# Altium project 2 лаба Вадим.PrjPcb
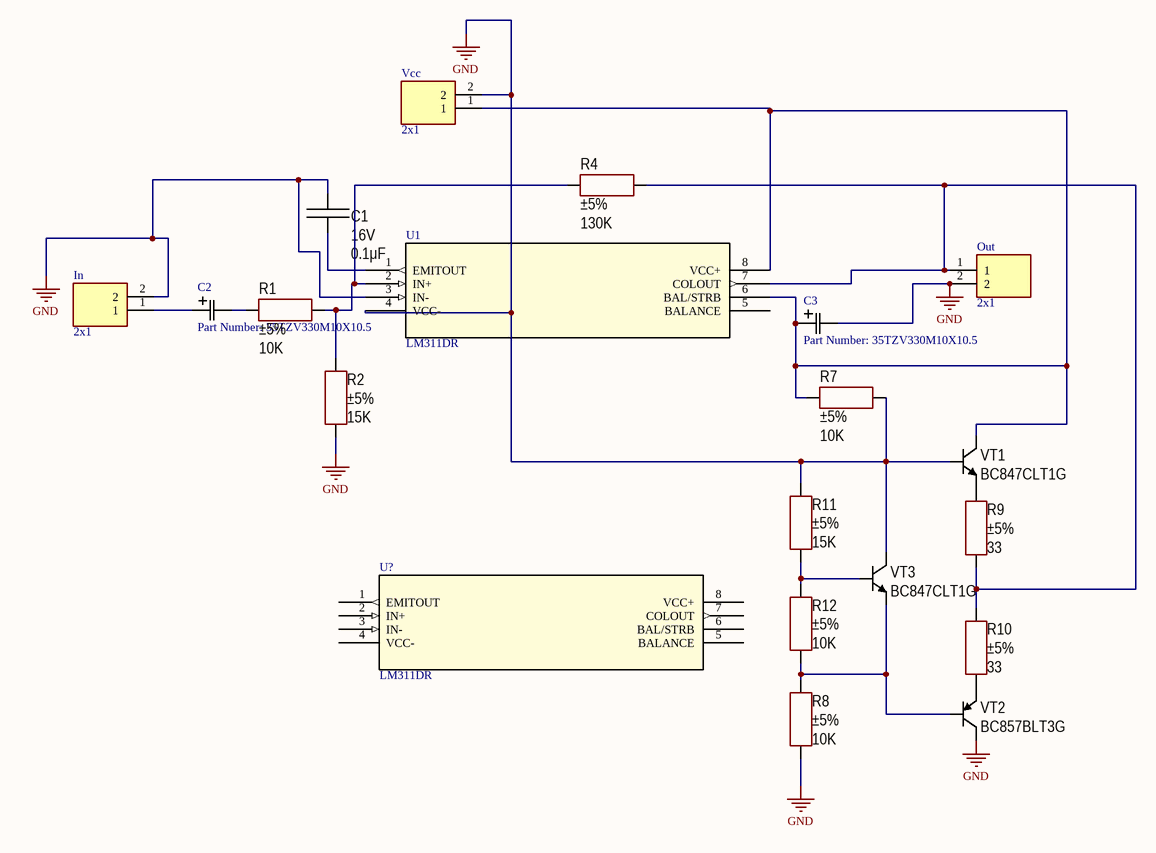
[diagram p0: pricipialka.SchDoc]
5 sheets, 20 parts. Net scope: global (net labels, ports and power ports of the same name join across sheets).
Board file: pechatka.PcbDoc
Sheets:
  pricipialka.SchDoc
  Перечень элементов.SchDoc
  Плата печатная.SchDoc
  Спецификация.SchDoc
  Спецификация 2.SchDoc

## Sheet pricipialka.SchDoc
size A4

### Parts
C1  value 0.1μF  Voltage: 16V  [CAP: 0805]
C2  Part Number: 35TZV330M10X10.5  [CAP_J-V_10X10P00]
C3  Part Number: 35TZV330M10X10.5  [CAP_J-V_10X10P00]
In  2х1  [2х1 SMD]
Out  2х1  [2х1 SMD]
R1  value 10K  Tolerance: ±5%  [RES: 0805]
R2  value 15K  Tolerance: ±5%  [RES: 0805]
R4  value 130K  Tolerance: ±5%  [RES: 0805]
R7  value 10K  Tolerance: ±5%  [RES: 0805]
R8  value 10K  Tolerance: ±5%  [RES: 0805]
R9  value 33  Tolerance: ±5%  [RES: 0805]
R10  value 33  Tolerance: ±5%  [RES: 0805]
R11  value 15K  Tolerance: ±5%  [RES: 0805]
R12  value 10K  Tolerance: ±5%  [RES: 0805]
U1  LM311DR  [D8]
U?  LM311DR  [D8]
Vcc  2х1  [2х1 SMD]
VT1  PartNumber: BC847CLT1G  [SOT23]
VT2  PartNumber: BC857BLT3G  [SOT23]
VT3  PartNumber: BC847CLT1G  [SOT23]

### Nets
GND: C1.2 C3.2 In.2 Out.2 R2.1 R7.2 R8.1 R11.2 U1.3(IN-) U1.4(VCC-) Vcc.2 VT1.1(B) VT2.3(C) VT3.3(C)
NetC1_1: C1.1 U1.1(EMITOUT)
NetC2_1: C2.1 In.1
NetC2_2: C2.2 R1.1
NetC3_1: C3.1 R7.1 U1.6(BAL/STRB) U1.8(VCC+) Vcc.1 VT1.3(C)
NetOut_1: Out.1 R4.2 R9.1 R10.2 U1.7(COLOUT)
NetR1_2: R1.2 R2.2 R4.1 U1.2(IN+)
NetR8_2: R8.2 R12.1 VT2.1(B) VT3.2(E)
NetR9_2: R9.2 VT1.2(E)
NetR10_1: R10.1 VT2.2(E)
NetR11_1: R11.1 R12.2 VT3.1(B)

Not connected (* = marked no-connect by the designer): U1 5(BALANCE); U? 1(EMITOUT) 2(IN+) 3(IN-) 4(VCC-) 5(BALANCE) 6(BAL/STRB) 7(COLOUT) 8(VCC+)

### Library data of the parts
C1 = Ceramic_0805: Manufacturer: Yageo; PartNumber: CC0805KRX7R7BB104; ValueManufacturerPartNumber: Ceramic capacitor, 0.1μF, X7R, ±10%, 16V, 0805, -55...+125°C; TypeCapacitor: Ceramic capacitor; Tolerance: ±10%; TypeDielectric: X7R; Package: 0805; HelpURL: https://www.digikey.com/product-detail/en/yageo/CC0805KRX7R7BB104/311-1142-1-ND/303052; Temperature: -55...+125°C
C2 C3 = 35TZV330M10X10.5: No Description Available; Vendor: Rubycon Netherlands; Built_By: EMA_Cory; Type: DEV; Manufacturer_Part_Number: 35TZV330M10X10.5; Copyright: Copyright (C) 2018 Accelerated Designs. All rights reserved; RefDes: RefDes; Value: Value
In Out Vcc = 2х1: Board-To-Board Connector, Straight, AMPMODU Mod II Series, Through Hole, Header, 2, 2.54 mm; MP: 826926-2; Centerline_Pitch: 2.54 mm[.1 in]; MF: TE Connectivity; Number_of_Positions: 2; Availability: Unavailable; Product_Type: Connector; Value: *; Package: None; SnapEDA_Link: https://www.snapeda.com/parts/826926-2/TE%20Connectivity%20AMP%20Connectors/view-part/554683/?ref=snap; TE_purchase_URL: https://www.te.com/usa-en/product-826926-2.html?te_bu=Cor&te_type=disp&te_campaign=seda_glo_cor-seda-global-disp-prtnr-fy19-seda-model-bom-cta_sma-317_1&elqCampaignId=32493; EU_RoHS_Compliance: Compliant; Price: None
R1 R7 R8 R12 = Resistor_0805: Manufacturer: Yageo; PartNumber: RC0805JR-07100RL; ValueManufacturerPartNumber: Resistor film, 10K, ±5%, 0805, 0.125W, -55...+125°C; TypeResistor: Resistor film; Power: 0.125W; Package: 0805; HelpURL: https://www.digikey.com/product-detail/en/yageo/RC0805JR-07100RL/311-100ARCT-ND/731185; Temperature: -55...+125°C
R2 R11 = Resistor_0805: Manufacturer: Yageo; PartNumber: RC0805JR-07100RL; ValueManufacturerPartNumber: Resistor film, 15K, ±5%, 0805, 0.125W, -55...+125°C; TypeResistor: Resistor film; Power: 0.125W; Package: 0805; HelpURL: https://www.digikey.com/product-detail/en/yageo/RC0805JR-07100RL/311-100ARCT-ND/731185; Temperature: -55...+125°C
R4 = Resistor_0805: Manufacturer: Yageo; PartNumber: RC0805JR-07100RL; ValueManufacturerPartNumber: Resistor film, 130K, ±5%, 0805, 0.125W, -55...+125°C; TypeResistor: Resistor film; Power: 0.125W; Package: 0805; HelpURL: https://www.digikey.com/product-detail/en/yageo/RC0805JR-07100RL/311-100ARCT-ND/731185; Temperature: -55...+125°C
R9 R10 = Resistor_0805: Manufacturer: Yageo; PartNumber: RC0805JR-07100RL; ValueManufacturerPartNumber: Resistor film, 33, ±5%, 0805, 0.125W, -55...+125°C; TypeResistor: Resistor film; Power: 0.125W; Package: 0805; HelpURL: https://www.digikey.com/product-detail/en/yageo/RC0805JR-07100RL/311-100ARCT-ND/731185; Temperature: -55...+125°C
U1 U? = LM311DR: Differential Comparator With Strobes; Manufacturer: Texas Instruments; GENERIC_PART_NUMBER: LM311; INDUSTRY_STD_PKG_TYPE: SOIC; PIN_COUNT: 8; PACKAGE_DESIGNATOR: D; Datasheet_URL: http://www.ti.com/lit/gpn/LM311; FAMILY_NAME: COMPARATOR; Copyright: Copyright (C) 2018 Accelerated Designs. All rights reserved; RefDes: RefDes; Type: DEV
VT1 VT3 = BJT_NPN_132: Manufacturer: ON Semiconductor; ValueManufacturerPartNumber: NPN transistor, 45V, 100mA, 100MHz, 300mW, 0.6V, 420, SOT-23, -55...+125°C; TypeTransistor: NPN transistor; VoltageCE: 45V; CurrentCE: 100mA; VoltageSaturation: 0.6V; Frequency: 100MHz; CurrentGain: 420; MaxPower: 300mW; Package: SOT-23; HelpURL: https://www.digikey.com/product-detail/en/on-semiconductor/BC847CLT1G/BC847CLT1GOSCT-ND/917836; Temperature: -55...+125°C
VT2 = BJT_PNP_123: Manufacturer: ON Semiconductor; ValueManufacturerPartNumber: PNP transistor, 45V, 100mA, 100MHz, 300mW, 0.65V, 220, SOT-23, -55...+125°C; TypeTransistor: PNP transistor; VoltageCE: 45V; CurrentCE: 100mA; VoltageSaturation: 0.65V; Frequency: 100MHz; CurrentGain: 220; MaxPower: 300mW; Package: SOT-23; HelpURL: https://www.digikey.com/product-detail/en/on-semiconductor/BC857BLT3G/BC857BLT3GOSCT-ND/2704963; Temperature: -55...+125°C

## Sheet Перечень элементов.SchDoc
size 209 x 297 mm; ApprovedBy: 1; CheckedBy: 2; Author: 3; SheetNumber: 1; SheetTotal: 1; Разработал: Гончаренко В.Ю.; Проверил: Смолин В.А.; Обозначение: СФ МЭИ ПЭ2-18 11.03.04 03 ПЭ3; Наименование1: Плата печатная; Наименование2: Перечень элементов; Литера2: У; Утвердил: Рассказа Д.С.; Компания: СФ НИУ МЭИ
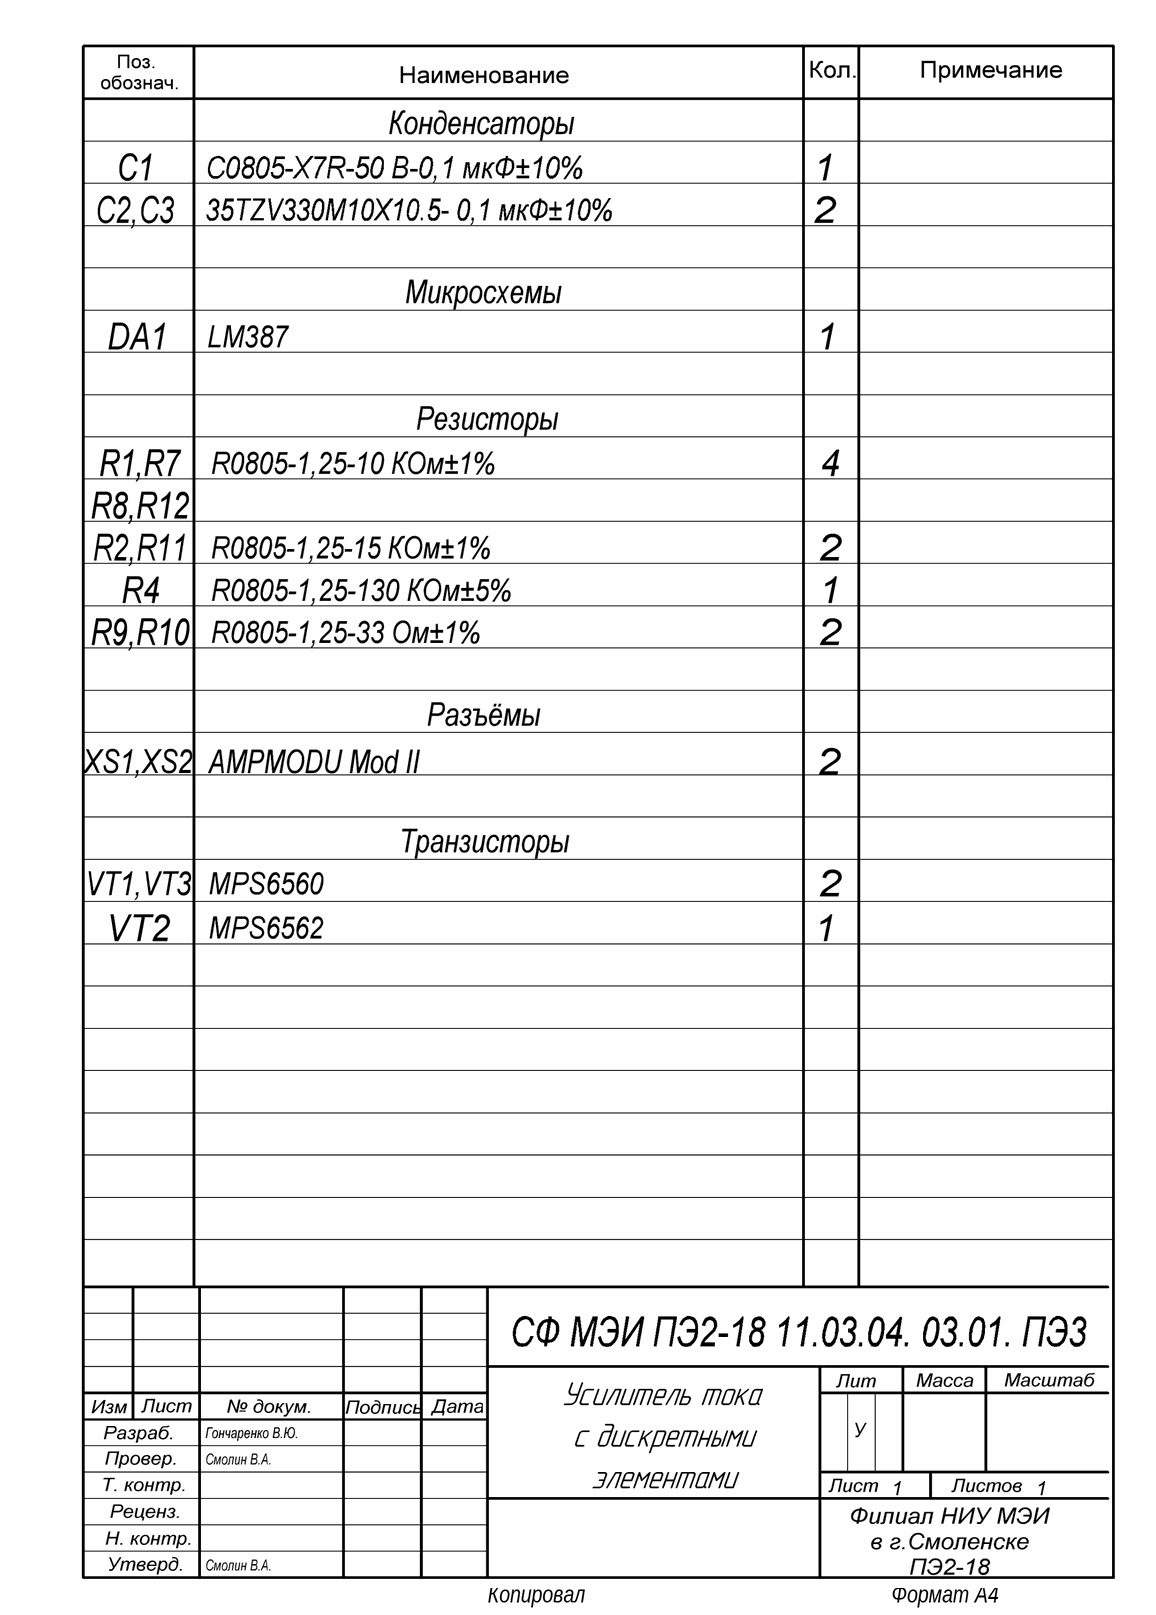
[diagram p1: Перечень элементов.SchDoc]

### Notes on the sheet
- Рассказа Д.С.
- Перв. примен.
- Справ. №
- Подп. и дата
- Инв. № дубл.
- Взам. инв. №
- Разраб.
- Изм.
- Лист
- № докум.
- Подп.
- Дата
- Лит.
- Масса
- Масштаб
- Пров.
- Т. контр.
- Листов
- Инв. № подл.
- Н. контр.
- Утв.
- Копировал
- Формат А4

## Sheet Плата печатная.SchDoc
size 420 x 297 mm; Децимальный номер: СФ МЭИ КР ПЭ2-18 11.03.04 03; Наименование. Строка 2: плата; Наименование. Строка 1: Печатная; Разработал: Гончаренко В.Ю.; Проверил: Смолин В.А.; Утвердил: Рассказа Д,С.; Литера: У; Масштаб: 2:1; Лист. Номер: 1; Лист. Всего: 4; Организация: НИУ СФ МЭИ
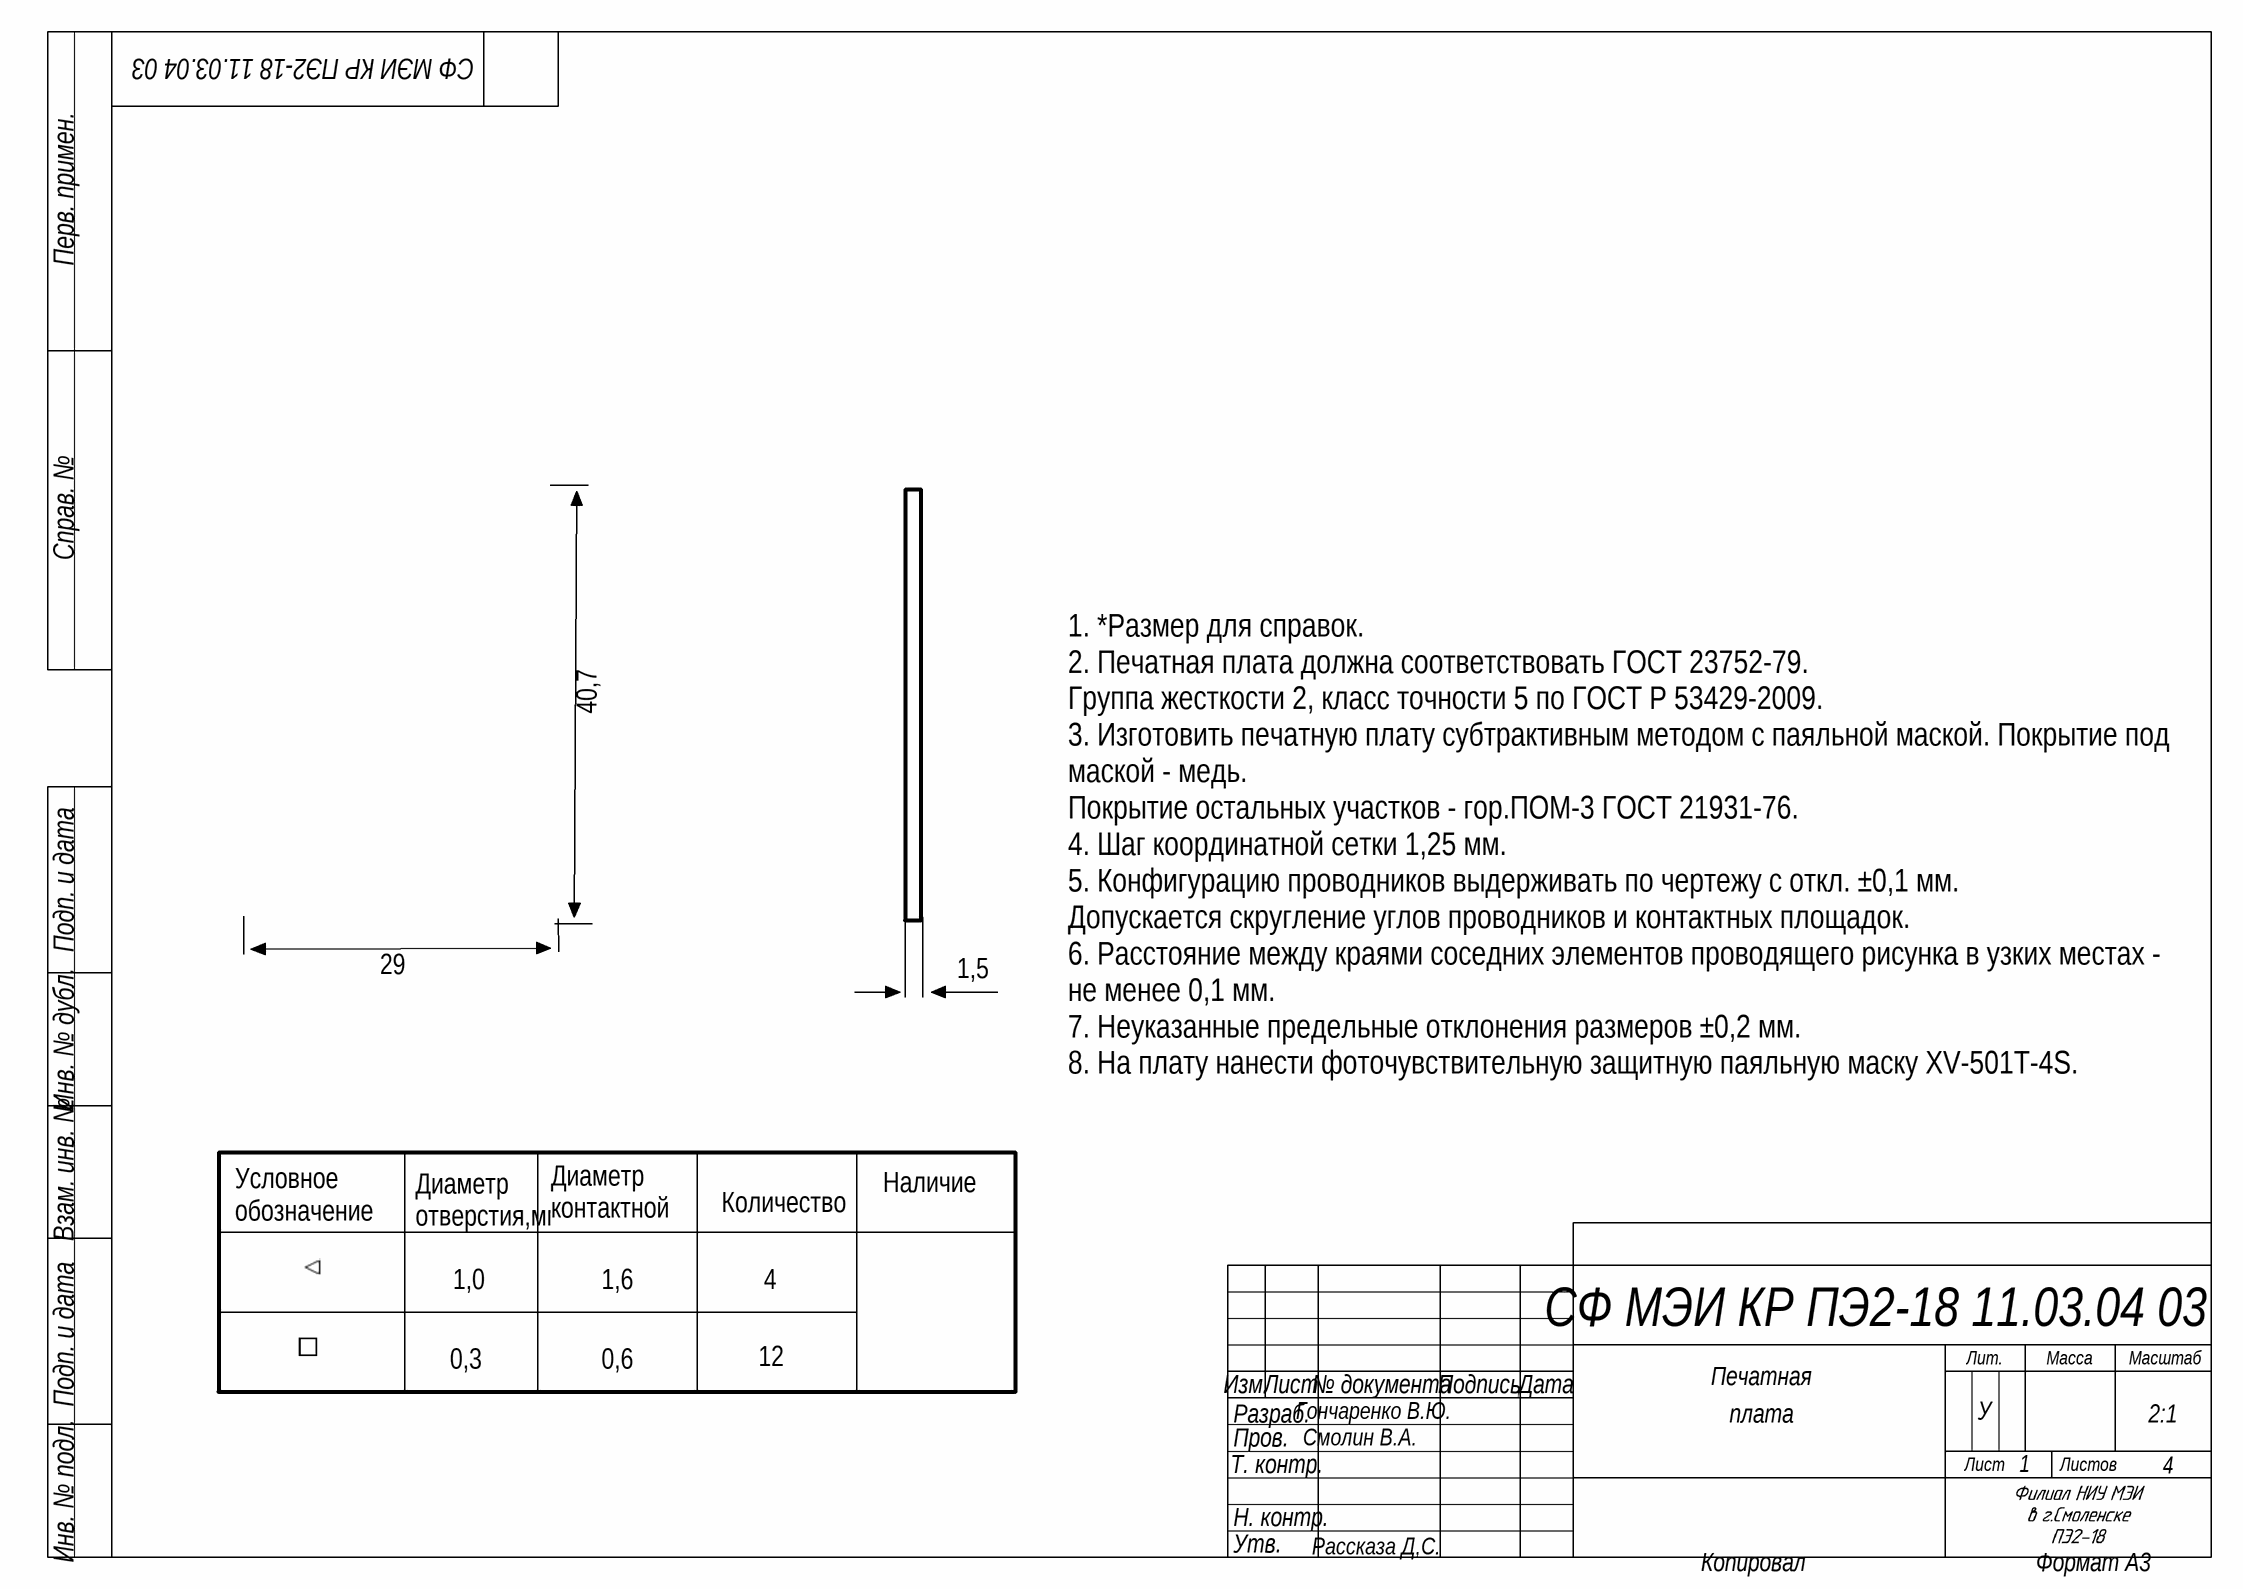
[diagram p2: Плата печатная.SchDoc]

### Notes on the sheet
- 40,7
- 29
- 1,5
- 1. *Размер для справок.
  2. Печатная плата должна соответствовать ГОСТ 23752-79.
  Группа жесткости 2, класс точности 5 по ГОСТ Р 53429-2009.
  3. Изготовить печатную плату субтрактивным методом с паяльной маской. Покрытие под маской - медь.
  Покрытие остальных участков - гор.ПОМ-3 ГОСТ 21931-76.
  4. Шаг координатной сетки 1,25 мм.
  5. Конфигурацию проводников выдерживать по чертежу с откл. ±0,1 мм.
  Допускается скругление углов проводников и контактных площадок.
  6. Расстояние между краями соседних элементов проводящего рисунка в узких местах - не менее 0,1 мм.
  7. Неуказанные предельные отклонения размеров ±0,2 мм.
  8. На плату нанести фоточувствительную защитную паяльную маску XV-501T-4S.
- Условное
  обозначение
  отверстия
- Диаметр
  отверстия,мм
- Диаметр
  контактной
  площадки,мм
- Количество
- Наличие
  металлизации
- 1,0
- 1,6
- 4
- Есть
- 0,3
- 0,6
- 12
- Перв. примен.
- Справ. №
- Подп. и дата
- Инв. № дубл.
- Взам. инв. №
- Разраб.
- Изм.
- Лист
- № документа
- Подпись
- Дата
- Лит.
- Масса
- Масштаб
- Т. контр.
- Пров.
- Листов
- Инв. № подл.
- Н. контр.
- Утв.
- Копировал
- Формат A3

## Sheet Спецификация.SchDoc
size 209 x 297 mm

### Notes on the sheet
- Перв. примен.
- Справ. №
- Подп. и дата
- Инв. № дубл.
- Взам. инв. №
- Разраб.
- Изм.
- Лист
- № докум.
- Подп.
- Дата
- Лит.
- Масса
- Масштаб
- Пров.
- Т. контр.
- Листов
- Инв. № подл.
- Н. контр.
- Утв.
- Копировал
- Формат А4
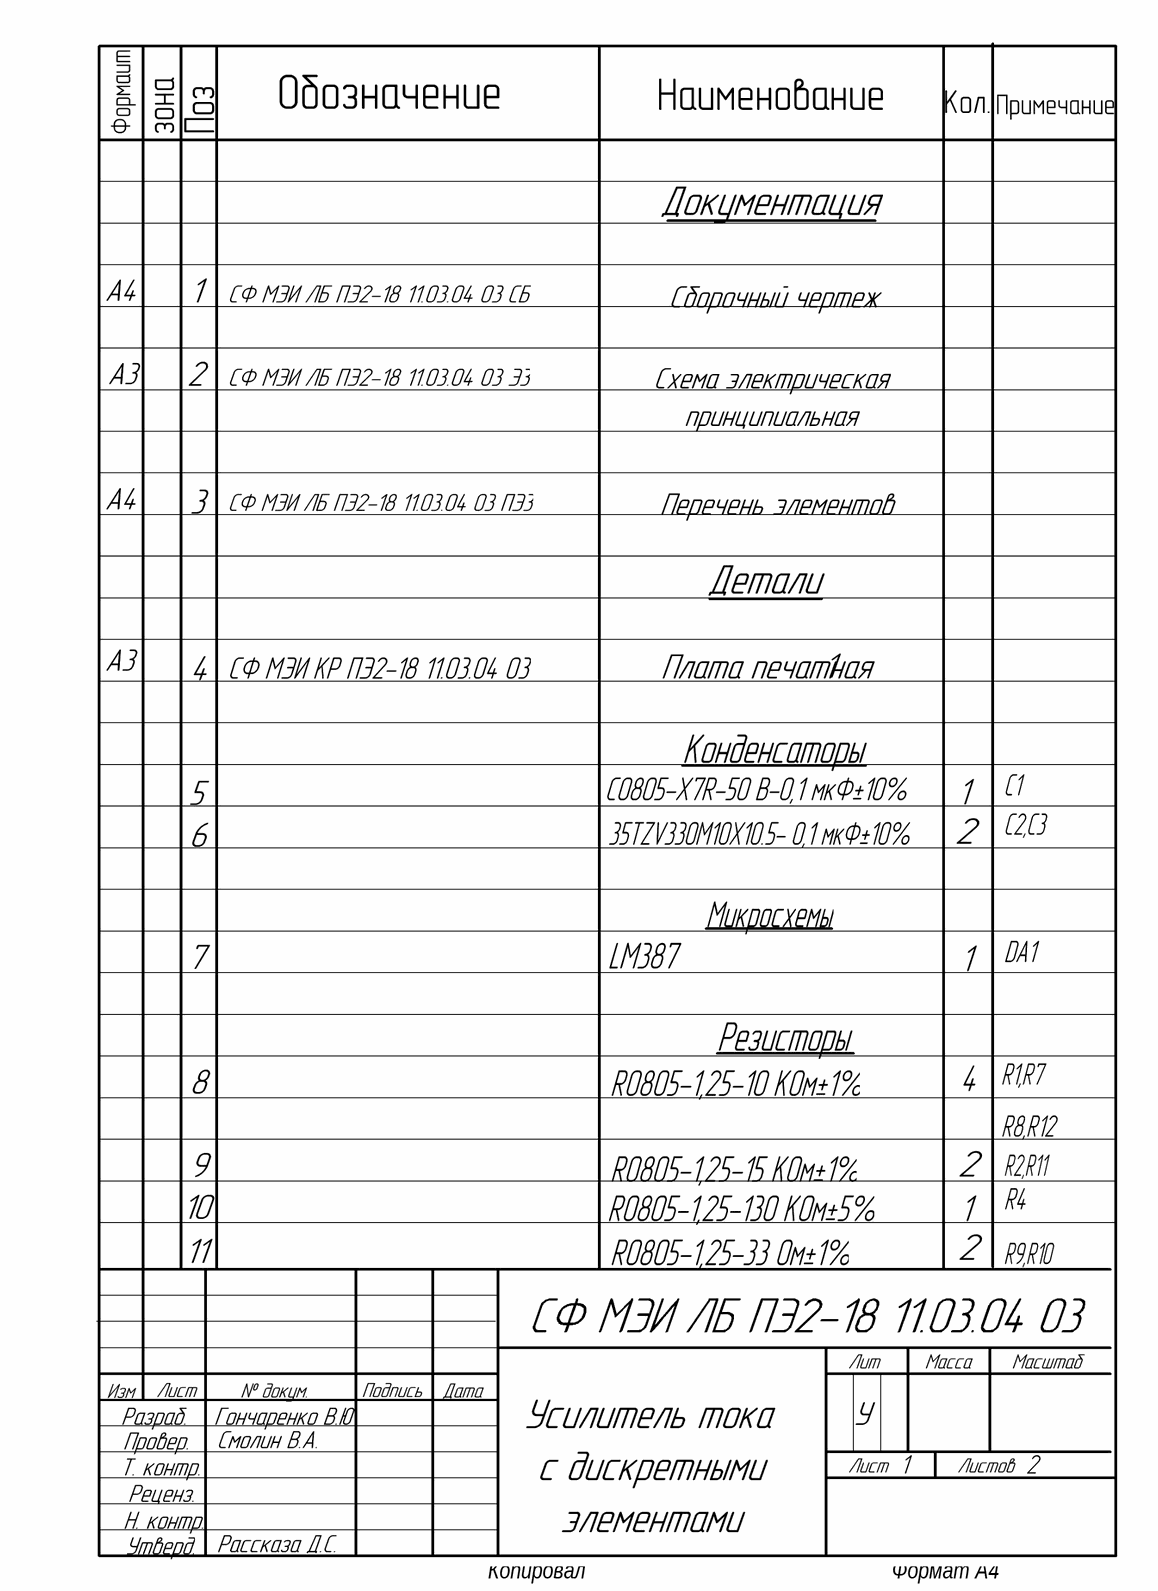
[diagram p3: Спецификация.SchDoc]

## Sheet Спецификация 2.SchDoc
size 209 x 297 mm
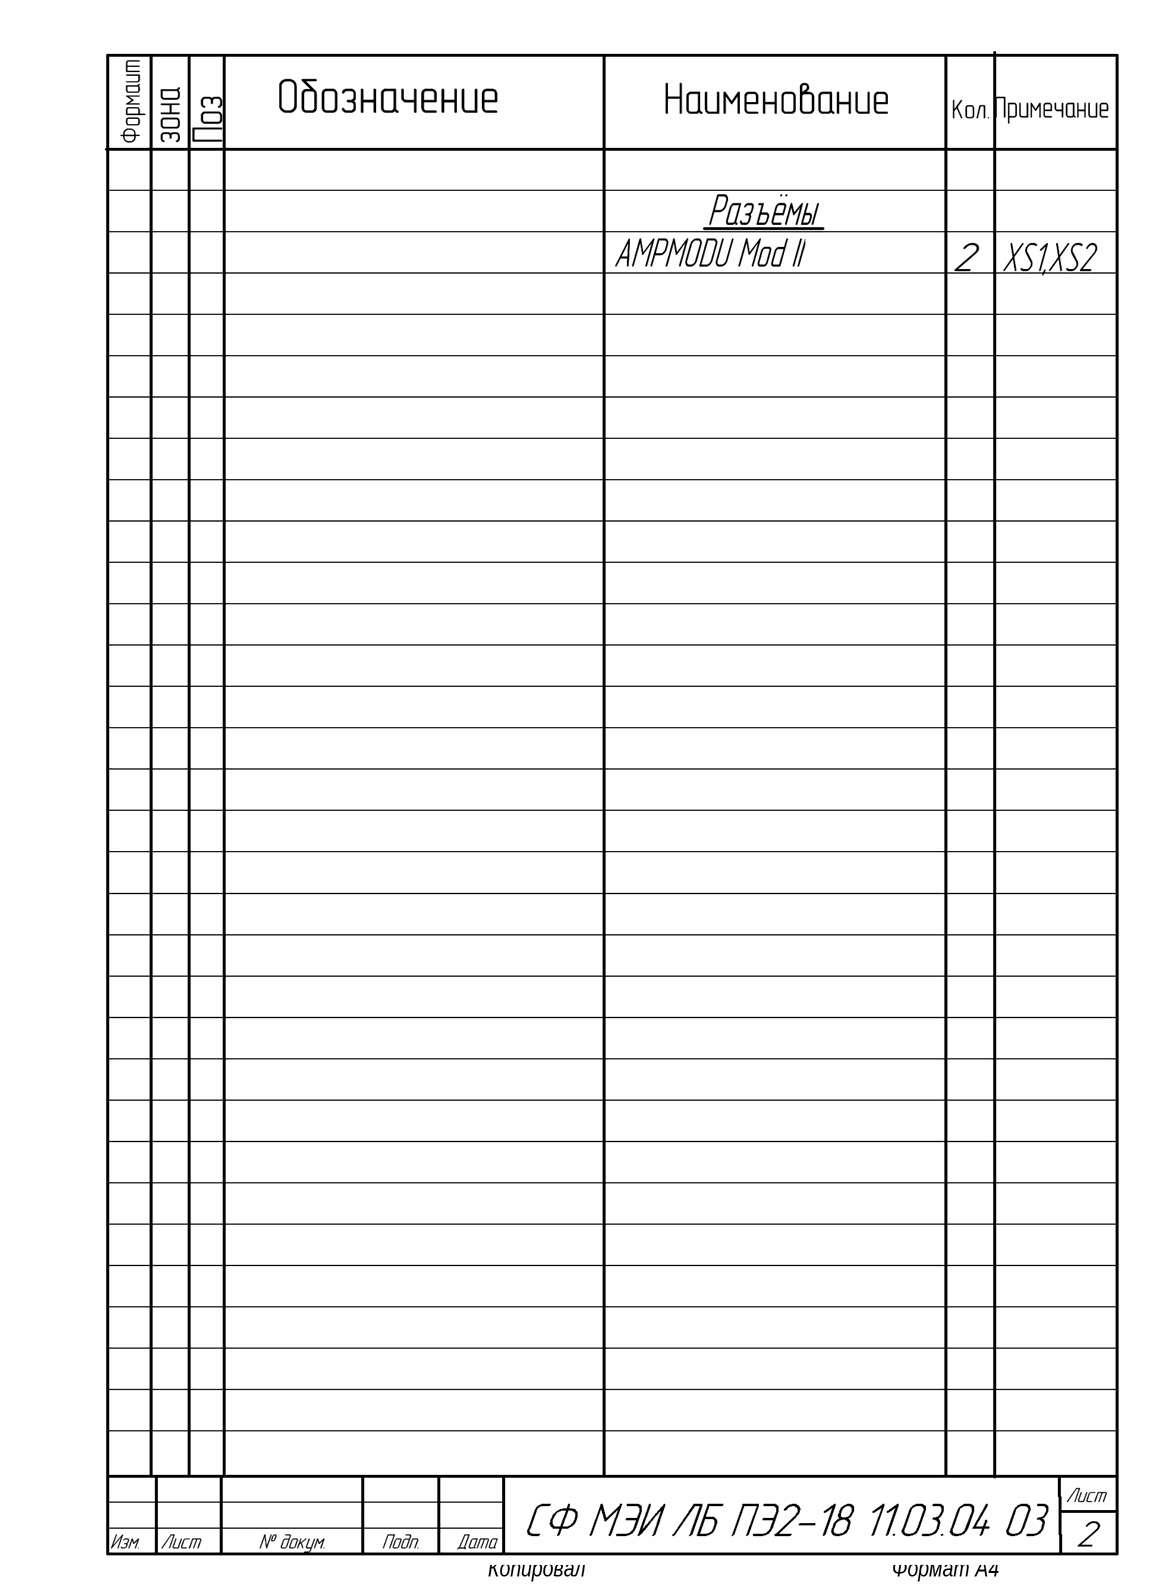
[diagram p4: Спецификация 2.SchDoc]

### Notes on the sheet
- Перв. примен.
- Справ. №
- Подп. и дата
- Инв. № дубл.
- Взам. инв. №
- Разраб.
- Изм.
- Лист
- № докум.
- Подп.
- Дата
- Лит.
- Масса
- Масштаб
- Пров.
- Т. контр.
- Листов
- Инв. № подл.
- Н. контр.
- Утв.
- Копировал
- Формат А4